# Altium schematic sheet ST_LINK_V2-1.SCHDOC: ST-Link/V2-1
size A4; Author: Ph.A; SheetNumber: 6; SheetTotal: 6
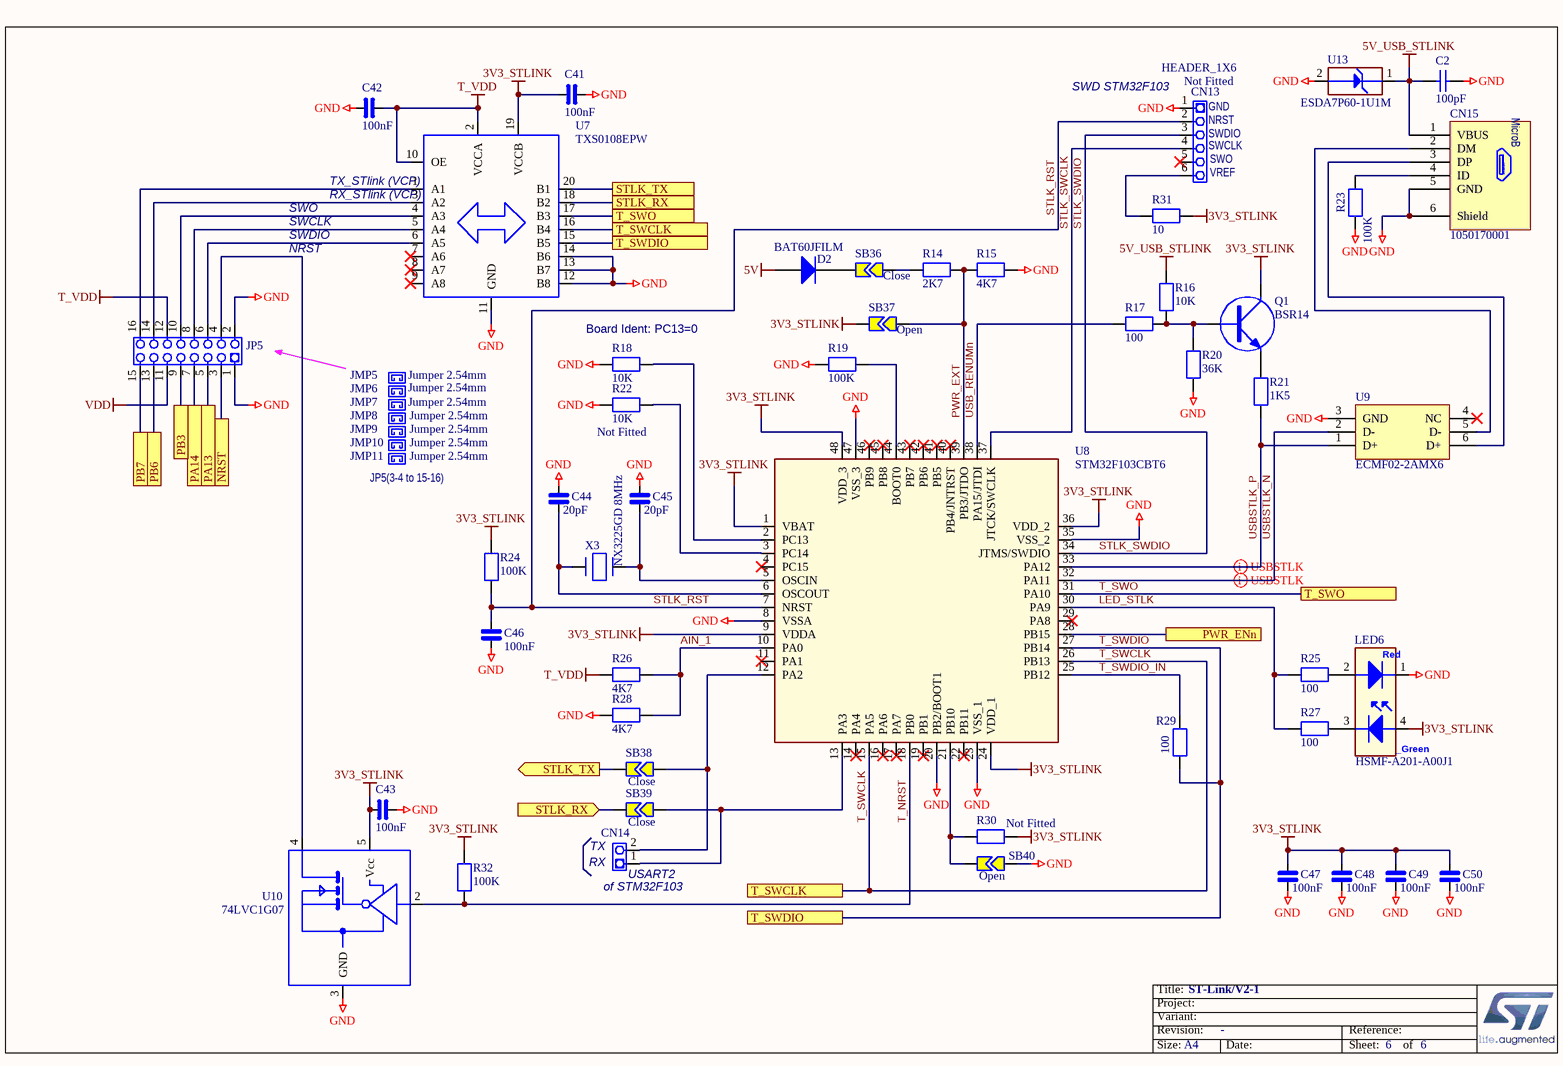
[diagram p0: ST_LINK_V2-1.SCHDOC]

## Parts
C2  value 100pF  [C0402]  (hidden comment: Capacitor)
C41  100nF  [0402_CAP_NPOL]
C42  100nF  [0402_CAP_NPOL]
C43  100nF  [0402_CAP_NPOL]
C44  20pF  [0402_CAP_NPOL]
C45  20pF  [0402_CAP_NPOL]
C46  100nF  [0402_CAP_NPOL]
C47  100nF  [0402_CAP_NPOL]
C48  100nF  [0402_CAP_NPOL]
C49  100nF  [0402_CAP_NPOL]
C50  100nF  [0402_CAP_NPOL]
CN13  HEADER_1X6  Fitted: Not Fitted  [Header NF 1x6x2.54 TH]
CN14  HEADER_1X2  [Header NF 1x2x2.54 TH]  (value not drawn)
CN15  1050170001  [USBMICROB_MOLEX_105017-0001_H2P90]
D2  BAT60JFILM  [SOD-323]
JMP5  Jumper 2.54mm  [Jumper 2.54mm BLACK]
JMP6  Jumper 2.54mm  [Jumper 2.54mm BLACK]
JMP7  Jumper 2.54mm  [Jumper 2.54mm BLACK]
JMP8  Jumper 2.54mm  [Jumper 2.54mm BLACK]
JMP9  Jumper 2.54mm  [Jumper 2.54mm BLACK]
JMP10  Jumper 2.54mm  [Jumper 2.54mm BLACK]
JMP11  Jumper 2.54mm  [Jumper 2.54mm BLACK]
JP5  HEADER_2X8  [Header M 2x8x2.54 TH V]  (value not drawn)
LED6  HSMF-A201-A00J1  [HSMF-A201]
Q1  BSR14  [SOT23-3]
R14  2K7  [0402_RES]
R15  4K7  [0402_RES]
R16  10K  [0402_RES]
R17  100  [0402_RES]
R18  10K  [0402_RES]
R19  100K  [0402_RES]
R20  36K  [0402_RES]
R21  1K5  [0402_RES]
R22  10K  Fitted: Not Fitted  [0402_RES]
R23  100K  [0402_RES]
R24  100K  [0402_RES]
R25  100  [0402_RES]
R26  4K7  [0402_RES]
R27  100  [0402_RES]
R28  4K7  [0402_RES]
R29  100  [0402_RES]
R30  Fitted: Not Fitted  [0402_RES]
R31  10  [0402_RES]
R32  100K  [0402_RES]
SB36  Close  [SB-tiny]
SB37  Open  [SB-tiny]
SB38  Close  [SB-tiny]
SB39  Close  [SB-tiny]
SB40  Open  [SB-tiny]
U7  TXS0108EPW  [TSSOP20]
U8  STM32F103CBT6  [LQFP48_7X7_P050]
U9  ECMF02-2AMX6  [ESD_QFN-6L_1P7X1P5_P050]
U10  74LVC1G07  [SOT353-1]
U13  value ESDA7P60-1U1M  [ESD_QFN2_1P6X1_P125]  (hidden comment: ESD-TRANSIL)
X3  value NX3225GD 8MHz  [CRY_NX3225GD_2P]  (hidden comment: XTAL_2_PINS)

## Ports
NRST, PA13, PA14, PB3, PB6, PB7, PWR_ENn, STLK_RX, STLK_RX (in), STLK_TX, STLK_TX (out), T_SWCLK, T_SWDIO, T_SWO

## Nets
3V3_STLINK: C41.1 C43.1 C47.1 C48.1 C49.1 C50.1 LED6.4 Q1.3(C) R24.2 R30.1 R31.2 R32.2 SB37.1 U7.19(VCCB) U8.1(VBAT) U8.9(VDDA) U8.24(VDD_1) U8.36(VDD_2) U8.48(VDD_3) U10.5(Vcc)
5V: D2.1(A)
5V_USB_STLINK: C2.1 CN15.1(VBUS) R16.2 U13.1(IO1)
GND: C2.2 C41.2 C42.1 C43.2 C44.1 C45.1 C46.1 C47.2 C48.2 C49.2 C50.2 CN13.1 CN15.5(GND) CN15.6(Shield) JP5.1 JP5.2 LED6.1 R15.2 R18.2 R19.1 R20.1 R22.2 R23.1 R28.2 SB40.2 U7.11(GND) U7.12(B8) U7.13(B7) U7.14(B6) U8.8(VSSA) U8.20(PB2/BOOT1) U8.23(VSS_1) U8.35(VSS_2) U8.47(VSS_3) U9.3(GND) U10.3(GND) U13.2(GND)
T_VDD: C42.2 JP5.12 R26.2 U7.2(VCCA) U7.10(OE)
VDD: JP5.11
AIN_1: R26.1 R28.1 U8.10(PA0)
LED_STLK: R25.2 R27.2 U8.30(PA9)
NRST: JP5.3 ; port NRST
PA13: JP5.5 ; port PA13
PA14: JP5.7 ; port PA14
PB3: JP5.9 ; port PB3
PB6: JP5.13 ; port PB6
PB7: JP5.15 ; port PB7
PWR_ENn: U8.28(PB15) ; port PWR_ENn
PWR_EXT: R14.2 R15.1 SB37.2 U8.39(PB3/JTDO)
STLK_RST: C46.2 CN13.2 R24.1 U8.7(NRST)
STLK_RX: SB39.1 U7.18(B2) ; port STLK_RX
STLK_SWCLK: CN13.4 U8.37(JTCK/SWCLK)
STLK_SWDIO: CN13.3 U8.34(JTMS/SWDIO)
STLK_TX: SB38.1 U7.20(B1) ; port STLK_TX
T_NRST: R32.1 U8.18(PB0) U10.2(A)
T_SWCLK: U7.16(B4) U8.15(PA5) U8.26(PB13) ; port T_SWCLK
T_SWDIO: R29.1 U7.15(B5) U8.27(PB14) ; port T_SWDIO
T_SWDIO_IN: R29.2 U8.25(PB12)
T_SWO: U7.17(B3) U8.31(PA10) ; port T_SWO
USB_RENUMn: R17.2 U8.38(PA15/JTDI)
USBSTLK_N: U8.32(PA11) U9.2(D-)
USBSTLK_P: R21.1 U8.33(PA12) U9.1(D+)
NetC44_2: C44.2 U8.6(OSCOUT) X3.2(X2)
NetC45_2: C45.2 U8.5(OSCIN) X3.1(X1)
NetCN13_6: CN13.6 R31.1
NetCN14_1: CN14.1 SB39.2 U8.13(PA3)
NetCN14_2: CN14.2 SB38.2 U8.12(PA2)
NetCN15_2: CN15.2(DM) U9.5(D-)
NetCN15_3: CN15.3(DP) U9.6(D+)
NetCN15_4: CN15.4(ID) R23.2
NetD2_2: D2.2(K) SB36.1
NetJP5_4: JP5.4 U10.4(Y)
NetJP5_6: JP5.6 U7.6(A5)
NetJP5_8: JP5.8 U7.5(A4)
NetJP5_10: JP5.10 U7.4(A3)
NetJP5_14: JP5.14 U7.3(A2)
NetJP5_16: JP5.16 U7.1(A1)
NetLED6_2: LED6.2 R25.1
NetLED6_3: LED6.3 R27.1
NetQ1_1: Q1.1(B) R16.1 R17.1 R20.2
NetQ1_2: Q1.2(E) R21.2
NetR14_1: R14.1 SB36.2
NetR18_1: R18.1 U8.2(PC13)
NetR19_2: R19.2 U8.44(BOOT0)
NetR22_1: R22.1 U8.3(PC14)
NetR30_2: R30.2 SB40.1 U8.21(PB10)

Not connected (* = marked no-connect by the designer): CN13 5*; U7 7(A6)* 8(A7)* 9(A8)*; U8 4(PC15)* 11(PA1)* 14(PA4)* 16(PA6)* 17(PA7)* 19(PB1)* 22(PB11)* 29(PA8)* 40(PB4/JNTRST)* 41(PB5)* 42(PB6)* 43(PB7)* 45(PB8)* 46(PB9)*; U9 4(NC)*

## Layout directives
differential pair; net class DIFF90: USBSTLK_N, USBSTLK_P

## Notes on the sheet
- (near CN13) SWD STM32F103
- (near CN13) SWDIO
- (near CN13) NRST
- (near CN13) GND
- TX_STlink (VCP)
- RX_STlink (VCP)
- (near CN13) SWCLK
- (near CN13) SWO
- (near CN13) VREF
- SWO
- SWCLK
- SWDIO
- NRST
- Board Ident: PC13=0
- (near JMP11) JP5(3-4 to 15-16)
- (near CN14) RX
- TX
- (near CN14) USART2
- (near CN14) of STM32F103
- Title:
- Project:
- Size:
- Revision:
- Variant:
- A4
- -
- Date:
- Reference:
- Sheet:
- of
- (in symbol 1050170001) MicroB
- (in symbol LD_BICOLOR_CMS) Red; _Green

## Library data of the parts
C2 = MCD-00205: Capacitor, MLCC, 100pF, 50V, NPO, 5%, 0402, T=0,5mm; Manufacturer_Part_Number: CC0402JRNPO9BN101; Manufacturer: YAGEO; ECCN_US: EAR99; ECCN_EU: NEC; Provided_By: SUBCO; Internal_Part_Number: MCD-00205; Status: Released; Part_Type: Capacitor; Package: C0402; ComponentLink1Description: Datasheet; ComponentLink1URL: http://tunmcdsvn.tun.st.com/Component_Datasheet_Library/Trunk/Capacitors/Yageo_Capacitor_NP0_16V-to-50V
C41-C50 = CAP_NPOL: Capacitor_not polarized
CN15 = 1050170001: USB-MICRO-B, 1050170001, SMT, MOLEX; Fitted: YES; Ordered_By: Subcon; ECCN_US/EU: n/a; Manuf_1: MOLEX; Manuf_Part_1: 1050170001; Distrib: DIGIKEY; Value: 1050170001; Order_Code: *
D2 = Diode: Default Diode; Code - JEDEC: DO-214-AB; Ordered by: STM; ECCN_US/EU: EAR99/NEC; Published: 8-Jun-2000; Revision: July-2002: Re-released for DXP Platform.; Publisher: Altium Limited
LED6 = LD_BICOLOR_CMS: Bicolor Led; Manuf_1: Avago Technologies; Manuf_2: kingbright; Manuf_Part_2: KAA-3528SURKCGKC; Manuf_Part_1: HSMF-A201-A00J1
Q1 = 2N2222: 2N2222_SOT23
R14-R32 = RES: Resistor
SB36-SB40 = Strap2: Solder Jumper; Solder: YES; Published: 24-Mar-1999; Revision: July-2002: Re-released for DXP Platform.; Publisher: Altium Limited
U7 = TXS0108EPW: TXS0108E Bi-directional Level Shifter TSSOP20
U8 = STM32F103CBT6: Medium-density performance line ARM-based 32-bit MCU with 128KB Flash; Manuf_1: STM; ECCN_US/EU: 3A991A2/NEC; Fitted: YES; Manuf_Part_1: STM32F103CBT6; Distrib: STM; Order_Code: STM32F103CBT6; Ordered_By: STM; Value: STM32F103CBT6
U9 = MCD-00649: Common mode filter with ESD protection for USB 2.0 interface; Part_Type: Diode; Manufacturer: STMICROELECTRONICS; BMS_Part_Number: 9151138; ECCN_US: EAR99; ECCN_EU: NEC; Provided_By: SUBCO with ST control; Internal_Part_Number: MCD-00649; Value: ECMF02-2AMX6; Status: Released; Manufacturer_Part_Number: ECMF02-2AMX6; ComponentLink1Description: Datasheet; ComponentLink1URL: http://tunmcdsvn.tun.st.com/Component_Datasheet_Library/Trunk/Diodes/STM_ESD_ECMF02-2AMX6
U13 = MCD-00251: High power transient voltage suppressor, 7V breakdown; Part_Type: Diode; Manufacturer: STMICROELECTRONICS; BMS_Part_Number: 9179042; ECCN_US: EAR99; ECCN_EU: NEC; Provided_By: SUBCO with ST control; Internal_Part_Number: MCD-00251; Status: Released; Manufacturer_Part_Number: ESDA7P60-1U1M; ComponentLink1Description: Datasheet; ComponentLink1URL: http://tunmcdsvn.tun.st.com/Component_Datasheet_Library/Trunk/Diodes/STM_ESD_ESDA7P60-1U1M
X3 = MCD-00092: Crystal 8MHz, 8pF, +-20ppm, 500ohms max,  SMD; Part_Type: Crystal_Osc; Manufacturer_Part_Number: NX3225GD 8MHz EXS00A-CG04874; Manufacturer: NDK; BMS_Part_Number: 9157029; ECCN_US: EAR99; ECCN_EU: NEC; Provided_By: SUBCO; Internal_Part_Number: MCD-00092; Status: Released; ComponentLink1Description: Datasheet; ComponentLink1URL: http://tunmcdsvn.tun.st.com/Component_Datasheet_Library/Trunk/Crystal_Osc/NDK_Crystal-For-ST_NX3225GD 8MHz EXS00A-CG04874 (EXS10B-20725); Order_Code_Digikey: 644-1391